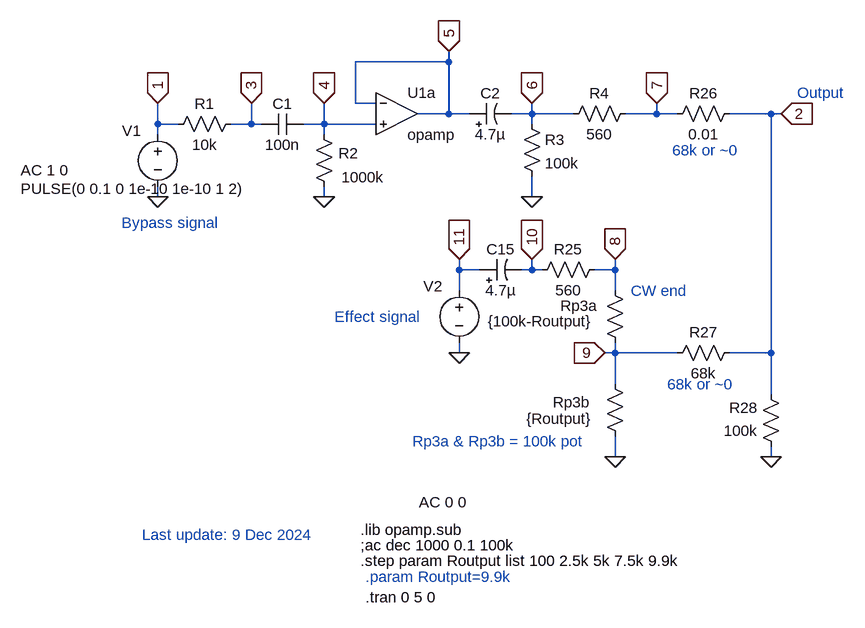
[diagram p0: schematic Klon-Centaur_bypass_v1.asc]
Klon-Centaur_bypass_v1.asc, the LTspice schematic file:
Version 4
SHEET 1 4496 5064
WIRE -352 2240 -352 2224
WIRE -352 2240 -496 2240
WIRE -496 2304 -496 2240
WIRE -464 2304 -496 2304
WIRE -352 2320 -352 2240
WIRE -352 2320 -400 2320
WIRE -320 2320 -352 2320
WIRE -224 2320 -224 2304
WIRE -224 2320 -256 2320
WIRE -160 2320 -224 2320
WIRE -32 2320 -32 2304
WIRE -32 2320 -80 2320
WIRE 0 2320 -32 2320
WIRE 144 2320 80 2320
WIRE 160 2320 144 2320
WIRE -800 2336 -800 2304
WIRE -768 2336 -800 2336
WIRE -656 2336 -656 2304
WIRE -656 2336 -688 2336
WIRE -640 2336 -656 2336
WIRE -544 2336 -544 2304
WIRE -544 2336 -576 2336
WIRE -464 2336 -544 2336
WIRE -224 2336 -224 2320
WIRE -800 2352 -800 2336
WIRE -544 2352 -544 2336
WIRE -800 2448 -800 2432
WIRE -544 2448 -544 2432
WIRE -224 2448 -224 2416
WIRE -336 2560 -336 2544
WIRE -304 2560 -336 2560
WIRE -224 2560 -224 2544
WIRE -224 2560 -240 2560
WIRE -208 2560 -224 2560
WIRE -96 2560 -96 2544
WIRE -96 2560 -128 2560
WIRE -336 2592 -336 2560
WIRE -96 2592 -96 2560
WIRE -336 2688 -336 2672
WIRE -96 2688 -96 2672
WIRE -96 2688 -112 2688
WIRE 0 2688 -96 2688
WIRE 144 2688 144 2320
WIRE 144 2688 80 2688
WIRE -96 2736 -96 2688
WIRE 144 2752 144 2688
WIRE -96 2848 -96 2816
WIRE 144 2848 144 2832
FLAG -800 2304 1
IOPIN -800 2304 In
FLAG -544 2448 0
FLAG -800 2448 0
FLAG -224 2448 0
FLAG 144 2848 0
FLAG -656 2304 3
IOPIN -656 2304 In
FLAG -544 2304 4
IOPIN -544 2304 In
FLAG -224 2304 6
IOPIN -224 2304 In
FLAG 160 2320 2
IOPIN 160 2320 In
FLAG -352 2224 5
IOPIN -352 2224 In
FLAG -96 2848 0
FLAG -336 2688 0
FLAG -96 2544 8
IOPIN -96 2544 In
FLAG -112 2688 9
IOPIN -112 2688 In
FLAG -224 2544 10
IOPIN -224 2544 In
FLAG -336 2544 11
IOPIN -336 2544 In
FLAG -32 2304 7
IOPIN -32 2304 In
SYMBOL voltage -800 2336 R0
WINDOW 0 -55 10 Left 2
WINDOW 123 -211 71 Left 2
WINDOW 39 0 0 Left 0
WINDOW 3 -211 99 Left 2
SYMATTR InstName V1
SYMATTR Value2 AC 1 0
SYMATTR Value PULSE(0 0.1 0 1e-10 1e-10 1 2)
SYMBOL res -672 2320 R90
WINDOW 0 0 56 VBottom 2
WINDOW 3 32 56 VTop 2
SYMATTR InstName R1
SYMATTR Value 10k
SYMBOL res -528 2448 R180
WINDOW 0 -37 67 Left 2
WINDOW 3 -77 30 Left 2
SYMATTR InstName R2
SYMATTR Value 1000k
SYMBOL cap -576 2320 R90
WINDOW 0 0 32 VBottom 2
WINDOW 3 32 32 VTop 2
SYMATTR InstName C1
SYMATTR Value 100n
SYMBOL OpAmps\\opamp -432 2256 R0
SYMATTR InstName U1a
SYMBOL res -240 2320 R0
SYMATTR InstName R3
SYMATTR Value 100k
SYMBOL res -64 2304 R90
WINDOW 0 0 56 VBottom 2
WINDOW 3 32 56 VTop 2
SYMATTR InstName R4
SYMATTR Value 560
SYMBOL res 160 2848 R180
WINDOW 0 36 76 Left 2
WINDOW 3 36 40 Left 2
SYMATTR InstName R28
SYMATTR Value 100k
SYMBOL polcap -320 2336 R270
WINDOW 0 32 32 VTop 2
WINDOW 3 0 32 VBottom 2
SYMATTR InstName C2
SYMATTR Value 4.7µ
SYMBOL res 96 2672 R90
WINDOW 0 0 56 VBottom 2
WINDOW 3 32 56 VTop 2
SYMATTR InstName R27
SYMATTR Value 68k
SYMBOL res -112 2720 R0
WINDOW 0 -80 44 Left 2
WINDOW 3 -121 69 Left 2
SYMATTR InstName Rp3b
SYMATTR Value {Routput}
SYMBOL res -112 2576 R0
WINDOW 0 -68 39 Left 2
WINDOW 3 -180 63 Left 2
SYMATTR InstName Rp3a
SYMATTR Value {100k-Routput}
SYMBOL res -112 2544 R90
WINDOW 0 0 56 VBottom 2
WINDOW 3 32 56 VTop 2
SYMATTR InstName R25
SYMATTR Value 560
SYMBOL polcap -304 2576 R270
WINDOW 0 32 32 VTop 2
WINDOW 3 0 32 VBottom 2
SYMATTR InstName C15
SYMATTR Value 4.7µ
SYMBOL voltage -336 2576 R0
WINDOW 0 -55 9 Left 2
WINDOW 123 -62 342 Left 2
WINDOW 39 0 0 Left 0
WINDOW 3 -289 58 Left 2
SYMATTR InstName V2
SYMATTR Value2 AC 0 0
SYMATTR Value ""
SYMBOL res 96 2304 R90
WINDOW 0 0 56 VBottom 2
WINDOW 3 32 56 VTop 2
SYMATTR InstName R26
SYMATTR Value 0.01
TEXT -488 2960 Left 2 !.lib opamp.sub
TEXT -488 2984 Left 2 !;ac dec 1000 0.1 100k
TEXT 184 2288 Left 2 ;Output
TEXT -856 2488 Left 2 ;Bypass signal
TEXT -488 3008 Left 2 !.step param Routput list 100 2.5k 5k 7.5k 9.9k
TEXT -480 3032 Left 2 ;.param Routput=9.9k
TEXT -72 2592 Left 2 ;CW end
TEXT -528 2632 Left 2 ;Effect signal
TEXT -8 2376 Left 2 ;68k or ~0
TEXT -16 2736 Left 2 ;68k or ~0
TEXT -408 2824 Left 2 ;Rp3a & Rp3b = 100k pot
TEXT -824 2968 Left 2 ;Last update: 9 Dec 2024
TEXT -480 3064 Left 2 !.tran 0 5 0

The netlist it stands for:
* Klon-Centaur_bypass_v1.asc
V1 1 0 PULSE(0 0.1 0 1e-10 1e-10 1 2) AC 1 0
R1 3 1 10k
R2 0 4 1000k
C1 4 3 100n
XU1a 5 4 5 opamp Aol=100K GBW=10Meg  ; pins invin noninvin out
R3 6 0 100k
R4 7 6 560
R28 0 2 100k
C2 5 6 4.7µ
R27 2 9 68k
Rp3b 9 0 {Routput}
Rp3a 8 9 {100k-Routput}
R25 8 10 560
C15 11 10 4.7µ
V2 11 0 AC 0 0
R26 2 7 0.01
.lib opamp.sub
;ac dec 1000 0.1 100k
* Output
* Bypass signal
.step param Routput list 100 2.5k 5k 7.5k 9.9k
* .param Routput=9.9k
* CW end
* Effect signal
* 68k or ~0
* 68k or ~0
* Rp3a & Rp3b = 100k pot
* Last update: 9 Dec 2024
.tran 0 5 0
.backanno
.end